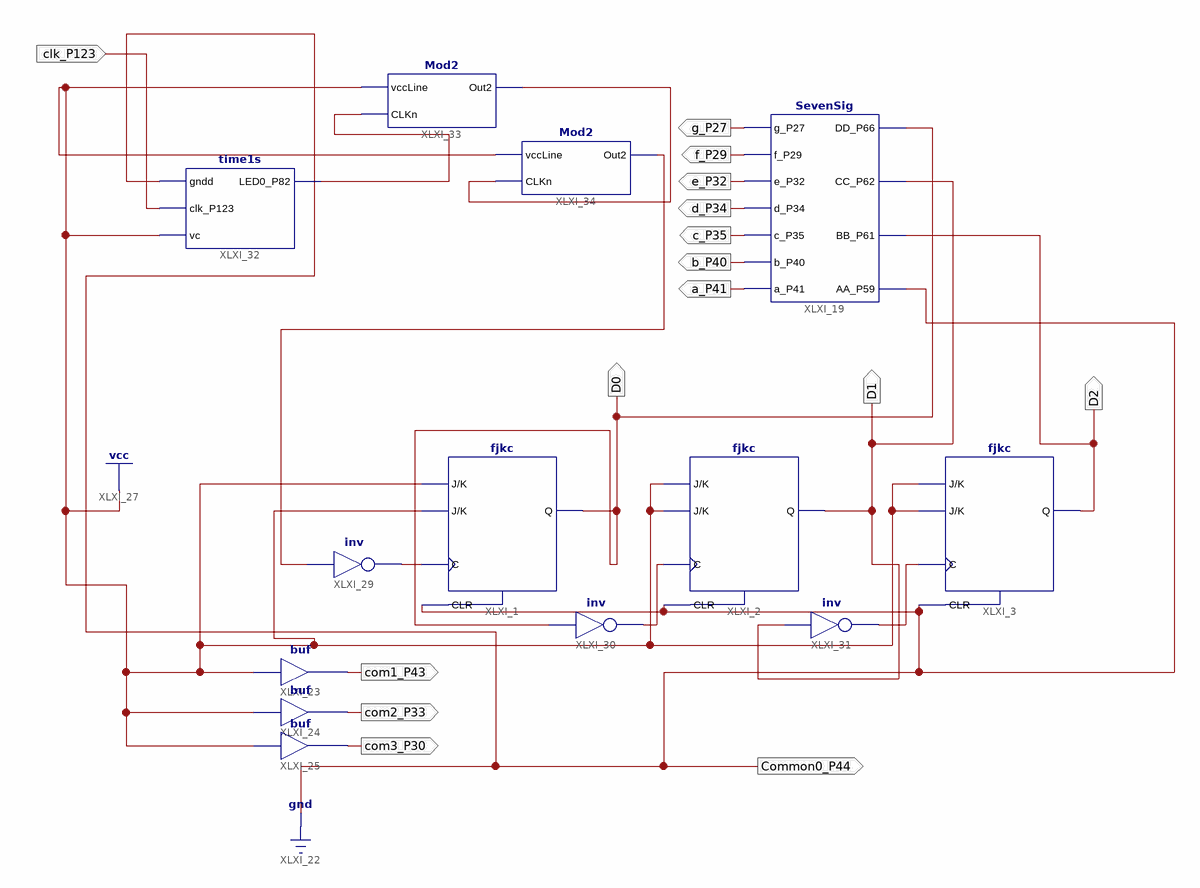
[diagram p0: schematic sheet 1]
// Xilinx ISE schematic Lab8_1_Counter.sch (spartan6) as structural Verilog: 13 symbols, 15 ports
module Lab8_1_Counter (
  input  clk_P123,
  output D0,
  output D1,
  output D2,
  output g_P27,
  output f_P29,
  output e_P32,
  output d_P34,
  output c_P35,
  output b_P40,
  output a_P41,
  output Common0_P44,
  output com1_P43,
  output com2_P33,
  output com3_P30
);

  wire led7_P67, XLXN_120, XLXN_123, XLXN_125, XLXN_126, XLXN_131;

  SevenSig XLXI_19 (
    .AA_P59(1'b0), .BB_P61(D2), .CC_P62(D1), .DD_P66(D0), .a_P41(a_P41), .b_P40(b_P40), .c_P35(c_P35),
    .d_P34(d_P34), .e_P32(e_P32), .f_P29(f_P29), .g_P27(g_P27));
  buf XLXI_23 (com1_P43, 1'b1);
  buf XLXI_24 (com2_P33, 1'b1);
  buf XLXI_25 (com3_P30, 1'b1);
  fjkc XLXI_3 (.C(XLXN_125), .CLR(1'b0), .J(1'b1), .K(1'b1), .Q(D2));
  fjkc XLXI_2 (.C(XLXN_123), .CLR(1'b0), .J(1'b1), .K(1'b1), .Q(D1));
  fjkc XLXI_1 (.C(XLXN_120), .CLR(1'b0), .J(1'b1), .K(1'b1), .Q(D0));
  not XLXI_29 (XLXN_120, XLXN_131);
  not XLXI_30 (XLXN_123, D0);
  not XLXI_31 (XLXN_125, D1);
  time1s XLXI_32 (.gndd(1'b0), .clk_P123(clk_P123), .vc(1'b1), .LED0_P82(led7_P67));
  Mod2 XLXI_33 (.vccLine(1'b1), .CLKn(led7_P67), .Out2(XLXN_126));
  Mod2 XLXI_34 (.vccLine(1'b1), .CLKn(XLXN_126), .Out2(XLXN_131));

  assign Common0_P44 = 1'b0;
endmodule
